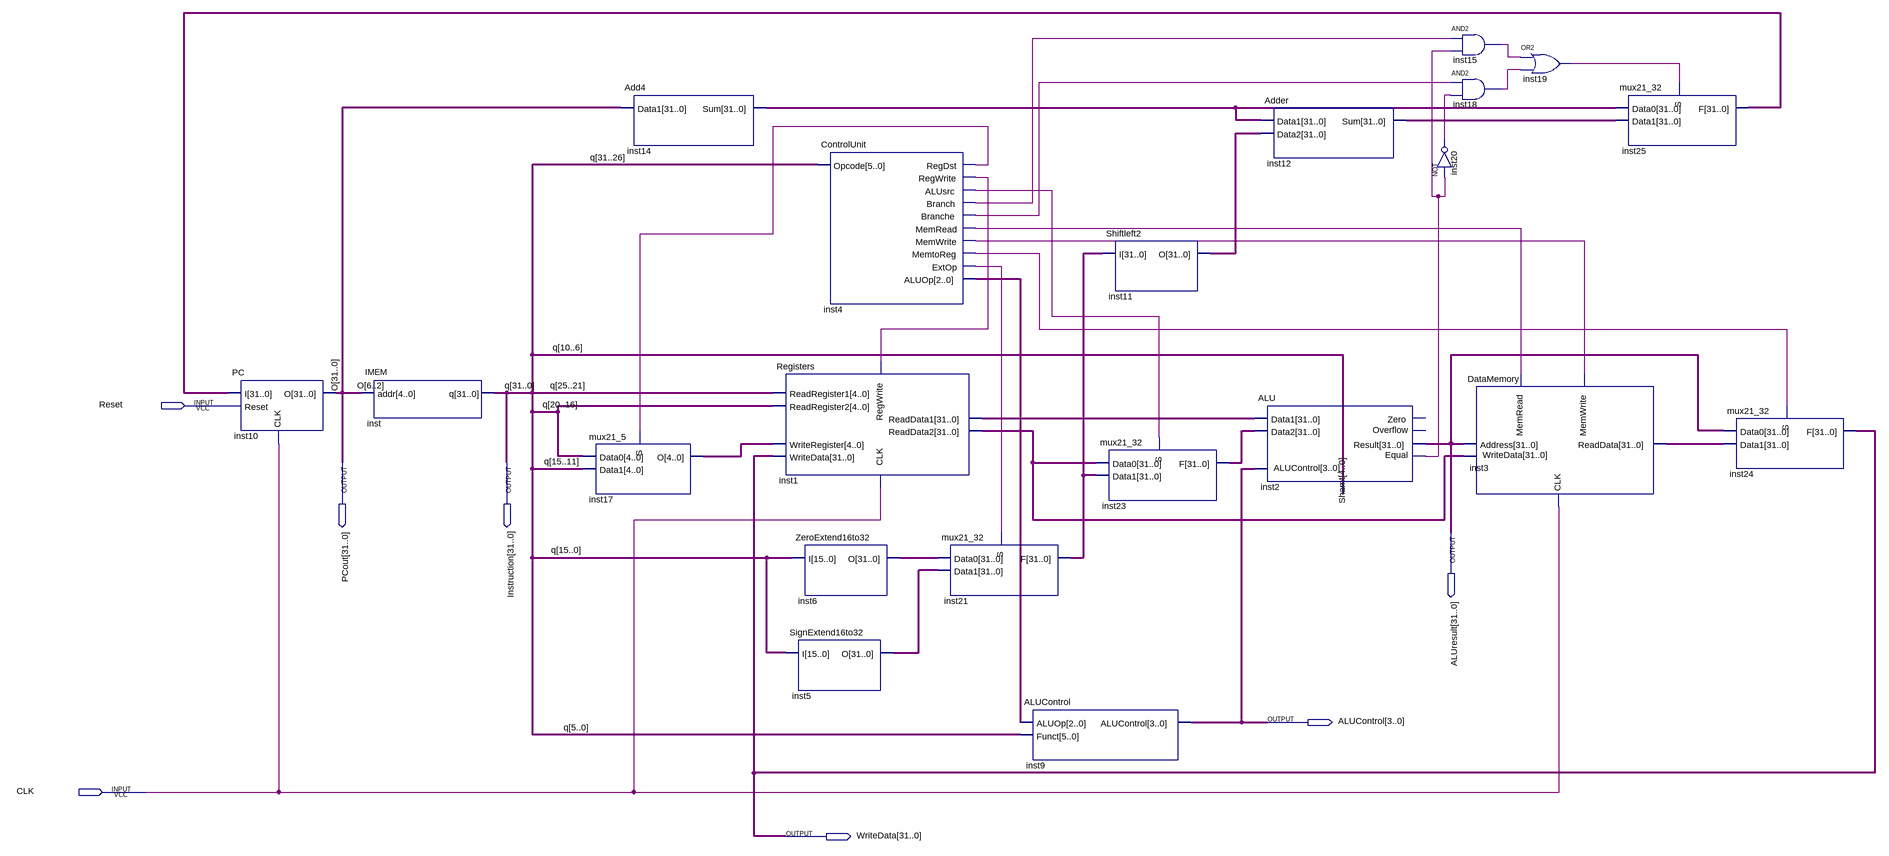
[diagram p0: schematic sheet]
// Quartus schematic CPU.bdf as structural Verilog: 21 symbols, 7 pins
module CPU (
  input  Reset,
  input  CLK,
  output [31:0] PCout,
  output [31:0] Instruction,
  output [31:0] ALUresult,
  output [3:0] ALUControl,
  output [31:0] WriteData
);

  wire inst2_equal, inst4_alusrc, inst4_branch, inst4_branche, inst4_extop, inst4_memread, inst4_memtoreg,
       inst4_memwrite, inst4_regdst, inst4_regwrite, inst15_out, inst18_out, inst19_out, inst20_out;
  wire [2:0] inst4_aluop;
  wire [4:0] inst17_o;
  wire [31:0] inst1_readdata1, inst1_readdata2, inst3_readdata, inst5_o, inst6_o, inst11_o, inst12_sum,
       inst14_sum, inst21_f, inst23_f, inst25_f;

  PC inst10 (.I(inst25_f), .Reset(Reset), .CLK(CLK), .O(PCout));
  IMEM inst (.addr(PCout[6:2]), .q(Instruction));
  mux21_5 inst17 (.Data0(Instruction[20:16]), .Data1(Instruction[15:11]), .S(inst4_regdst), .O(inst17_o));
  Add4 inst14 (.Data1(PCout), .Sum(inst14_sum));
  ControlUnit inst4 (
    .Opcode(Instruction[31:26]), .RegDst(inst4_regdst), .RegWrite(inst4_regwrite), .ALUsrc(inst4_alusrc),
    .Branch(inst4_branch), .Branche(inst4_branche), .MemRead(inst4_memread), .MemWrite(inst4_memwrite),
    .MemtoReg(inst4_memtoreg), .ExtOp(inst4_extop), .ALUOp(inst4_aluop));
  Registers inst1 (
    .ReadRegister1(Instruction[25:21]), .WriteData(WriteData), .ReadRegister2(Instruction[20:16]),
    .WriteRegister(inst17_o), .CLK(CLK), .RegWrite(inst4_regwrite), .ReadData1(inst1_readdata1),
    .ReadData2(inst1_readdata2));
  ZeroExtend16to32 inst6 (.I(Instruction[15:0]), .O(inst6_o));
  SignExtend16to32 inst5 (.I(Instruction[15:0]), .O(inst5_o));
  mux21_32 inst21 (.Data0(inst6_o), .Data1(inst5_o), .S(inst4_extop), .F(inst21_f));
  ALUControl inst9 (.ALUOp(inst4_aluop), .Funct(Instruction[5:0]), .ALUControl(ALUControl));
  Shiftleft2 inst11 (.I(inst21_f), .O(inst11_o));
  mux21_32 inst23 (.Data0(inst1_readdata2), .Data1(inst21_f), .S(inst4_alusrc), .F(inst23_f));
  Adder inst12 (.Data1(inst14_sum), .Data2(inst11_o), .Sum(inst12_sum));
  ALU inst2 (
    .Data1(inst1_readdata1), .Data2(inst23_f), .ALUControl(ALUControl), .Shamt(Instruction[10:6]),
    .Result(ALUresult), .Equal(inst2_equal));  // open: Zero, Overflow
  and inst15 (inst15_out, inst4_branch, inst2_equal);
  and inst18 (inst18_out, inst4_branche, inst20_out);
  not inst20 (inst20_out, inst2_equal);
  DataMemory inst3 (
    .WriteData(inst1_readdata2), .Address(ALUresult), .MemRead(inst4_memread), .MemWrite(inst4_memwrite),
    .CLK(CLK), .ReadData(inst3_readdata));
  or inst19 (inst19_out, inst15_out, inst18_out);
  mux21_32 inst25 (.Data0(inst14_sum), .Data1(inst12_sum), .S(inst19_out), .F(inst25_f));
  mux21_32 inst24 (.Data0(ALUresult), .Data1(inst3_readdata), .S(inst4_memtoreg), .F(WriteData));

  // Other names for the same wires on the sheet: q[31:0] = Instruction; O[31:0] = PCout
endmodule
